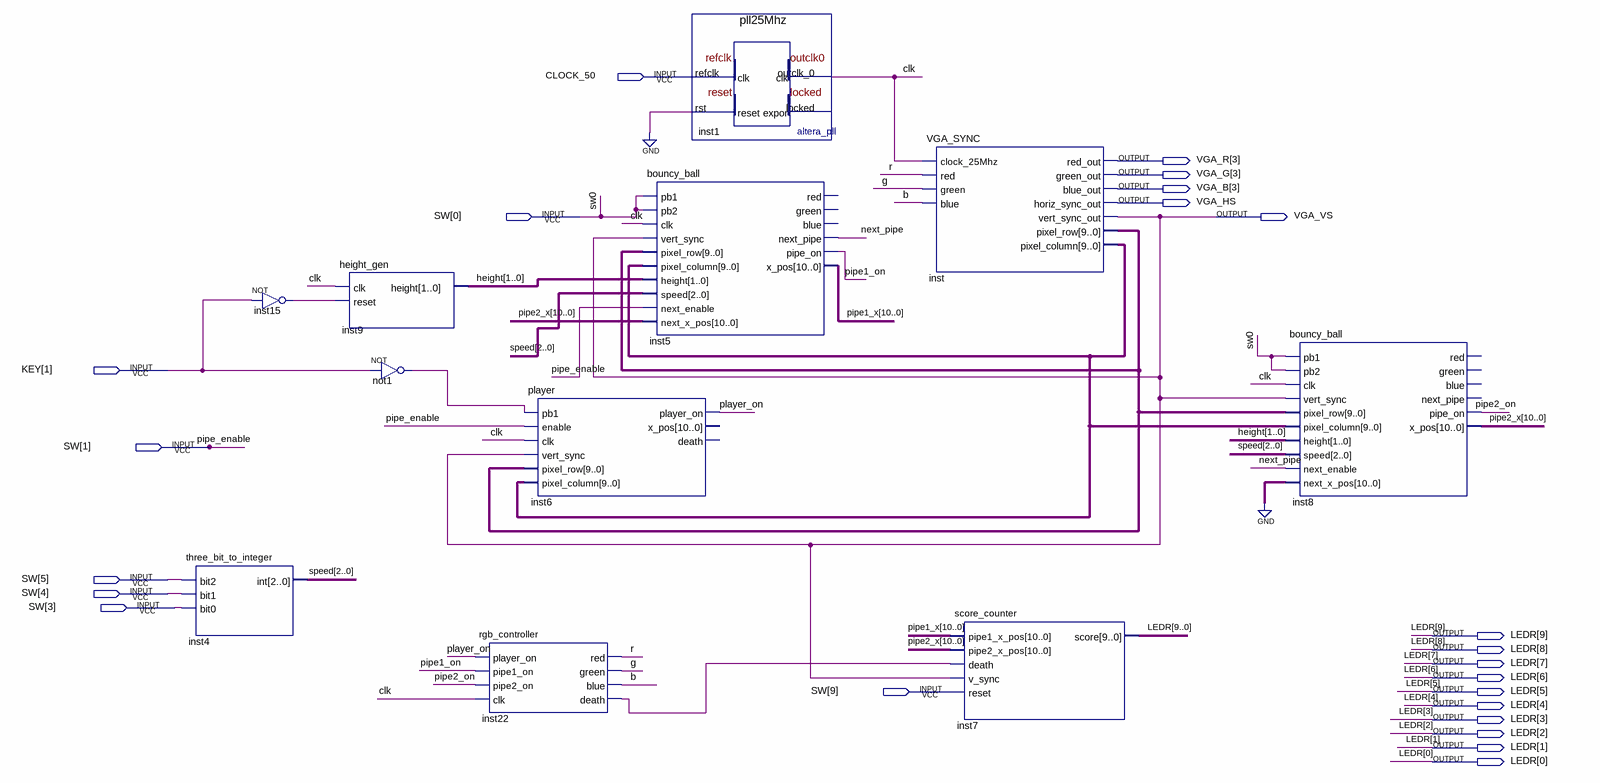
[diagram p0: schematic sheet]
// Quartus schematic pipe_tester.bdf as structural Verilog: 11 symbols, 23 pins
module pipe_tester (
  input  CLOCK_50,
  input  [9:0] SW,
  input  [1:1] KEY,
  output [3:3] VGA_R,
  output [3:3] VGA_G,
  output [3:3] VGA_B,
  output VGA_HS,
  output VGA_VS,
  output [9:0] LEDR
);

  wire b, clk, g, inst15_out, inst22_death, next_pipe, not1_out, pipe1_on, pipe2_on, player_on, r;
  wire [1:0] height;
  wire [2:0] speed;
  wire [9:0] inst_pixel_column, inst_pixel_row;
  wire [10:0] pipe1_x, pipe2_x;

  three_bit_to_integer inst4 (.bit2(SW[5]), .bit1(SW[4]), .bit0(SW[3]), .\int (speed));
  not inst15 (inst15_out, KEY[1]);
  height_gen inst9 (.clk(clk), .reset(inst15_out), .height(height));
  not not1 (not1_out, KEY[1]);
  rgb_controller inst22 (
    .player_on(player_on), .pipe1_on(pipe1_on), .pipe2_on(pipe2_on), .clk(clk), .red(r), .green(g), .blue(b),
    .death(inst22_death));
  player inst6 (
    .pb1(not1_out), .enable(SW[1]), .clk(clk), .vert_sync(VGA_VS), .pixel_row(inst_pixel_row),
    .pixel_column(inst_pixel_column), .player_on(player_on));  // open: x_pos, death
  bouncy_ball inst5 (
    .pb1(SW[0]), .pb2(SW[0]), .clk(clk), .vert_sync(VGA_VS), .pixel_row(inst_pixel_row),
    .pixel_column(inst_pixel_column), .height(height), .speed(speed), .next_enable(SW[1]),
    .next_x_pos(pipe2_x), .next_pipe(next_pipe), .pipe_on(pipe1_on), .x_pos(pipe1_x));  // open: red, green, blue
  pll25Mhz inst1 (.refclk(CLOCK_50), .rst(1'b0), .outclk_0(clk));  // open: locked
  VGA_SYNC inst (
    .clock_25Mhz(clk), .red(r), .green(g), .blue(b), .red_out(VGA_R[3]), .green_out(VGA_G[3]),
    .blue_out(VGA_B[3]), .horiz_sync_out(VGA_HS), .vert_sync_out(VGA_VS), .pixel_row(inst_pixel_row),
    .pixel_column(inst_pixel_column));
  score_counter inst7 (
    .pipe1_x_pos(pipe1_x), .pipe2_x_pos(pipe2_x), .death(inst22_death), .v_sync(VGA_VS), .score(LEDR));  // open: reset
  bouncy_ball inst8 (
    .pb1(SW[0]), .pb2(SW[0]), .clk(clk), .vert_sync(VGA_VS), .pixel_row(inst_pixel_row),
    .pixel_column(inst_pixel_column), .height(height), .speed(speed), .next_enable(next_pipe),
    .next_x_pos({11{1'b0}}), .pipe_on(pipe2_on), .x_pos(pipe2_x));  // open: red, green, blue, next_pipe

  // Other names for the same wires on the sheet: pipe_enable = SW[1]
endmodule
